# Altium project ESC_dev_board.PrjPcb
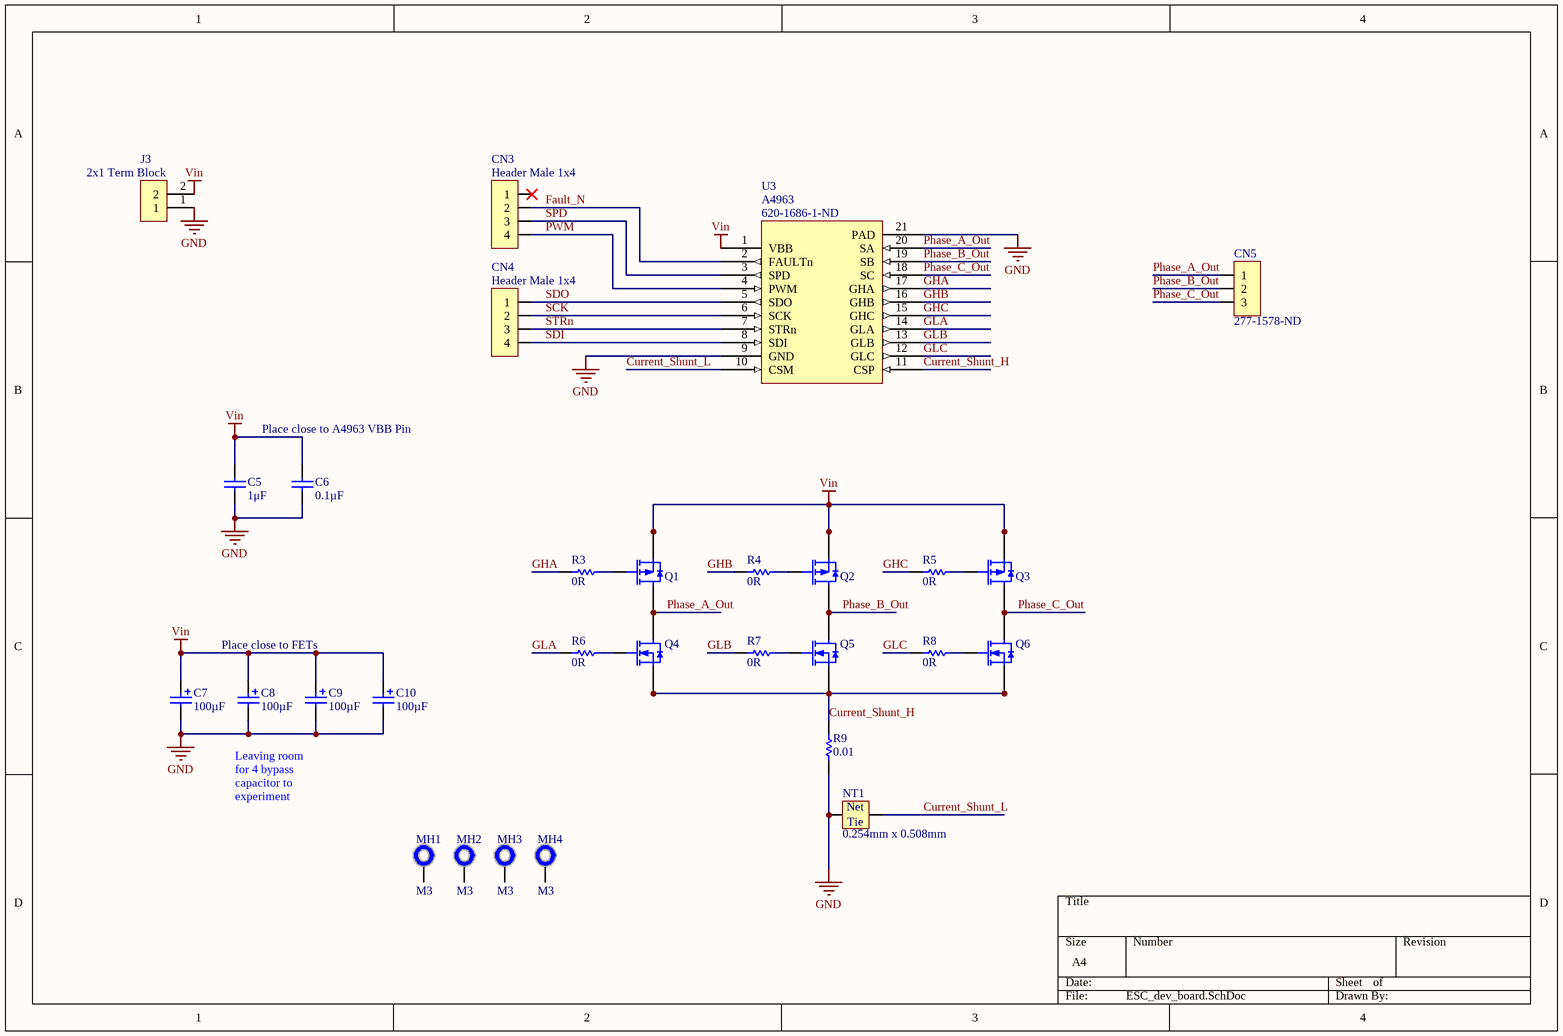
[diagram p0: ESC_dev_board.SchDoc]
1 sheet, 29 parts. Net scope: global (net labels, ports and power ports of the same name join across sheets).
Board file: ESC_dev_board.PcbDoc

## Sheet ESC_dev_board.SchDoc
size A4

### Parts
C5  1μF  [CAPC1608N(0603")]
C6  Capacitance: 0.1µF  [CAPC1608N(0603")]  (hidden comment: 0.1uF, 50V, 10%, X7R, 0603)
C7  100µF  [Radial_CAN_6.6mm]
C8  100µF  [Radial_CAN_6.6mm]
C9  100µF  [Radial_CAN_6.6mm]
C10  100µF  [Radial_CAN_6.6mm]
CN3  Header Male 1x4  [Header, Male, 1X4]
CN4  Header Male 1x4  [Header, Male, 1X4]
CN5  Supplier Part Number 1: 277-1578-ND  [3x1, Terminal Block, Pitch: 5mm, Screw, THT]  (hidden comment: 3x1, Terminal Block, Pitch: 5mm, Screw, THT)
J3  2x1 Term Block  [2X1 Terminal Blocks Phoenix Contact 5mm]
MH1  M3  [Clearance_M3_PLATED]  (no BOM)
MH2  M3  [Clearance_M3_PLATED]  (no BOM)
MH3  M3  [Clearance_M3_PLATED]  (no BOM)
MH4  M3  [Clearance_M3_PLATED]  (no BOM)
NT1  0.254mm x 0.508mm  [NETTIE_20mil]  (net tie, no BOM)
Q1  SI7625DN-T1-GE3  [PowerPAK 1212-8]  (value not drawn)
Q2  SI7625DN-T1-GE3  [PowerPAK 1212-8]  (value not drawn)
Q3  SI7625DN-T1-GE3  [PowerPAK 1212-8]  (value not drawn)
Q4  SIS476DN-T1-GE3  [PowerPAK 1212-8]  (value not drawn)
Q5  SIS476DN-T1-GE3  [PowerPAK 1212-8]  (value not drawn)
Q6  SIS476DN-T1-GE3  [PowerPAK 1212-8]  (value not drawn)
R3  0R  [RESC1608N(0603")]
R4  0R  [RESC1608N(0603")]
R5  0R  [RESC1608N(0603")]
R6  0R  [RESC1608N(0603")]
R7  0R  [RESC1608N(0603")]
R8  0R  [RESC1608N(0603")]
R9  0.01  [RESC6332N(2512")]
U3  A4963  Supplier Part Number 1: 620-1686-1-ND  [TSOP65P640X120_HS-21M]

### Nets
GND: C5.1(Anode) C6.1(Anode) C7.2(Cathode) C8.2(Cathode) C9.2(Cathode) C10.2(Cathode) J3.1 NT1.1 R9.1 U3.9(GND) U3.21(PAD)
Vin: C5.2(Cathode) C6.2(Cathode) C7.1(Anode) C8.1(Anode) C9.1(Anode) C10.1(Anode) J3.2 Q1.1(Source) Q1.2(Source) Q1.3(Source) Q2.1(Source) Q2.2(Source) Q2.3(Source) Q3.1(Source) Q3.2(Source) Q3.3(Source) U3.1(VBB)
Current_Shunt_H: Q4.1(Source) Q4.2(Source) Q4.3(Source) Q5.1(Source) Q5.2(Source) Q5.3(Source) Q6.1(Source) Q6.2(Source) Q6.3(Source) R9.2 U3.11(CSP)
Current_Shunt_L: NT1.2 U3.10(CSM)
Fault_N: CN3.2 U3.2(FAULTn)
GHA: R3.1 U3.17(GHA)
GHB: R4.1 U3.16(GHB)
GHC: R5.1 U3.15(GHC)
GLA: R6.1 U3.14(GLA)
GLB: R7.1 U3.13(GLB)
GLC: R8.1 U3.12(GLC)
Phase_A_Out: CN5.1 Q1.5(Drain) Q1.6(Drain) Q1.7(Drain) Q1.8(Drain) Q1.9(Drain) Q4.5(Drain) Q4.6(Drain) Q4.7(Drain) Q4.8(Drain) Q4.9(Drain) U3.20(SA)
Phase_B_Out: CN5.2 Q2.5(Drain) Q2.6(Drain) Q2.7(Drain) Q2.8(Drain) Q2.9(Drain) Q5.5(Drain) Q5.6(Drain) Q5.7(Drain) Q5.8(Drain) Q5.9(Drain) U3.19(SB)
Phase_C_Out: CN5.3 Q3.5(Drain) Q3.6(Drain) Q3.7(Drain) Q3.8(Drain) Q3.9(Drain) Q6.5(Drain) Q6.6(Drain) Q6.7(Drain) Q6.8(Drain) Q6.9(Drain) U3.18(SC)
PWM: CN3.4 U3.4(PWM)
SCK: CN4.2 U3.6(SCK)
SDI: CN4.4 U3.8(SDI)
SDO: CN4.1 U3.5(SDO)
SPD: CN3.3 U3.3(SPD)
STRn: CN4.3 U3.7(STRn)
NetQ1_4: Q1.4(Gate) R3.2
NetQ2_4: Q2.4(Gate) R4.2
NetQ3_4: Q3.4(Gate) R5.2
NetQ4_4: Q4.4(Gate) R6.2
NetQ5_4: Q5.4(Gate) R7.2
NetQ6_4: Q6.4(Gate) R8.2

Not connected (* = marked no-connect by the designer): CN3 1*; MH1 1; MH2 1; MH3 1; MH4 1

### Notes on the sheet
- Place close to A4963 VBB Pin
- Place close to FETs
- Leaving room for 4 bypass capacitor to experiment with. It normal operation, 1 or 2 should be sufficient
- (in symbol Net Tie, 20mil) Net; Tie

### Library data of the parts
C5 = 1uF 50V 0603 SMD, Ceramic: Capacitor, Ceramic, 50V, +/- 10%, 0603 SMD, X5R; PackageDescription: Chip Capacitor; Value: 1μF; Created By: Lyden Smith; Date Created: 2017-10-26; Supplier 1: Digi-Key; Supplier Part Number 1: 1276-1860-6-ND
C6 = 0.1uF, 50V, 10%, X7R, 0603: 0.1µF ±20% Ceramic Capacitor X7R 0603 (1608 Metric); Mounting Type: Surface Mount, MLCC; Operating Temperature: -55°C ~ 125°C; Package / Case: 0603 (1608 Metric); ComponentLink1Description: Digi-Key; ComponentLink1URL: https://www.digikey.ca/product-detail/en/tdk-corporation/C1608X7R1H104M080AA/445-5098-1-ND/2093713; Supplier 1: Digi-Key; Created By: Poorna Chander Kalidas; Supplier Part Number 1: 445-5098-1-ND
C7-C10 = 100uF, 35V, 20%, 30mOhm, Alum, SMD: 100µF 35V Aluminum Polymer Capacitor Radial, Can - SMD 30mOhm 2000 Hrs @ 105°C; Created By: Poorna Chander Kalidas; PackageDescription: Can; Value: 100µF; Date Created: 2020-02-15; Supplier 1: Digi-Key; Supplier Part Number 1: 732-11942-1-ND
CN3 CN4 = Header, Male, 1x4: 1x4, Pads Pitch: 0.1" (2.54mm), Through hole; Made Bates: Andy Bates; Supplier 1: Digikey; Supplier 1 Part Number: 952-2266-ND
J3 = 2x1 Terminal Block, 20A, 12-20AWG: Made by: Andy Bates; Date Made: 2017-11-14; Supplier 1: Digi-Key; Supplier Part Number 1: 277-6405-ND
MH1-MH4 = Mounting Hole, M3, Plated: Created By: Ashwin Sira; Publisher: AUVic; Date Created: 2016-06-08
NT1 = Net Tie, 20mil: Net Tie, 20mil by 20mil; Created By: Ashwin Sira; Publisher: AUVic; Date Created: 2016-06-17; Size: 0.254mm x 0.508mm
Q1-Q3 = SI7625DN-T1-GE3: P-Channel 30V 35A (Tc) 3.7W (Ta), 52W (Tc) Surface Mount PowerPAK® 1212-8; Created By: Poorna Chander Kalidas; Supplier 1: Digi-Key; Supplier Part Number 1: SI7625DN-T1-GE3CT-ND
Q4-Q6 = SIS476DN-T1-GE3: N-Channel 30V 40A (Tc) 3.7W (Ta), 52W (Tc) Surface Mount PowerPAK® 1212-8; Created By: Poorna Chander Kalidas; ComponentLink1Description: Digi-Key; ComponentLink1URL: https://www.digikey.ca/product-detail/en/diodes-incorporated/DMN3023L-7/DMN3023L-7DICT-ND/5453155; Supplier 1: Digi-Key; Supplier Part Number 1: SIS476DN-T1-GE3CT-ND
R3-R8 = 0R, 1%, 1/10W, 0603 SMD: Made By: Ashwin Sira; Owned By: AUVic; Created On: 14-05-31; Last Edited: 14-05-31; Value: 0R; Supplier 1: Digi-Key; Supplier Part Number 1: 311-0.0GRCT-ND
R9 = 0R01, 1%, 3W, 2512 SMD: RES 0.01 OHM 1% 3W 2512; Created By: Poorna Chander Kalidas; Created On: 2020-02-15; Supplier 1: Digi-Key; Supplier Part Number 1: CRA2512-FZ-R010ELFCT-ND; Value: 0.01
U3 = A4963, BLDC, 3Phase: A4963, BLDC, 3 Phase, Sensorless; Supplier 1: Digi-Key; Created By: Poorna Chander Kalidas
CN5 = 3x1, Terminal Block, Pitch: 5mm, Screw, THT: Publisher: AUVic, Ashwin Sira; Date Published: 2014-06-03; Last Updated: *; Reviewed By: *; Supplier 1: Digi-Key